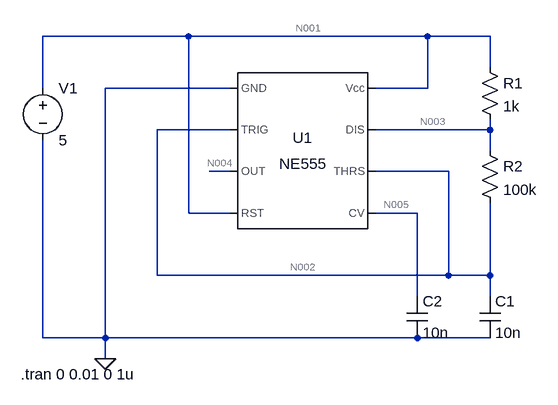
[diagram p0: schematic Draft1.asc]
Draft1.asc, the LTspice schematic file:
Version 4
SHEET 1 880 680
WIRE 16 16 -208 16
WIRE 384 16 16 16
WIRE 480 16 384 16
WIRE 480 64 480 16
WIRE -208 96 -208 16
WIRE 80 96 -112 96
WIRE 384 96 384 16
WIRE 384 96 304 96
WIRE 80 160 -32 160
WIRE 480 160 480 144
WIRE 480 160 304 160
WIRE 480 192 480 160
WIRE 80 224 48 224
WIRE 416 224 304 224
WIRE 16 288 16 16
WIRE 80 288 16 288
WIRE 368 288 304 288
WIRE -32 384 -32 160
WIRE 416 384 416 224
WIRE 416 384 -32 384
WIRE 480 384 480 272
WIRE 480 384 416 384
WIRE 368 416 368 288
WIRE 480 416 480 384
WIRE -208 480 -208 176
WIRE -112 480 -112 96
WIRE -112 480 -208 480
WIRE 368 480 -112 480
WIRE 480 480 368 480
WIRE -112 512 -112 480
FLAG -112 512 0
SYMBOL Misc\\NE555 192 192 R0
SYMATTR InstName U1
SYMBOL voltage -208 80 R0
WINDOW 123 0 0 Left 0
WINDOW 39 0 0 Left 0
SYMATTR InstName V1
SYMATTR Value 5
SYMBOL res 464 48 R0
SYMATTR InstName R1
SYMATTR Value 1k
SYMBOL res 464 176 R0
SYMATTR InstName R2
SYMATTR Value 100k
SYMBOL cap 464 416 R0
SYMATTR InstName C1
SYMATTR Value 10n
SYMBOL cap 352 416 R0
SYMATTR InstName C2
SYMATTR Value 10n
TEXT -242 536 Left 2 !.tran 0 0.01 0 1u

The netlist it stands for:
* Draft1.asc
XU1 0 N002 N004 N001 N005 N002 N003 N001 NE555  ; pins GND TRIG OUT RST CV THRS DIS Vcc
V1 N001 0 5
R1 N001 N003 1k
R2 N003 N002 100k
C1 N002 0 10n
C2 N005 0 10n
.tran 0 0.01 0 1u
.lib NE555.sub
.backanno
.end

* Results of the author's LTspice run, read from the files saved beside the schematic
* Operating Point, zero values left out:
*   V(n002) = 4.999 V
*   V(n005) = 3.333 V
*   V(n001) = 5 V
*   V(n003) = 5 V
*   V(n004) = 5 V
*   I(R2) = 9.998 nA
*   I(R1) = 16.67 nA
*   I(V1) = -1.611 mA
*   Ix(u1:1) = -1.611 mA
*   Ix(u1:2) = 4.999 nA
*   Ix(u1:4) = 22.67 µA
*   Ix(u1:6) = 4.999 nA
*   Ix(u1:7) = 6.672 nA
*   Ix(u1:8) = 1.588 mA
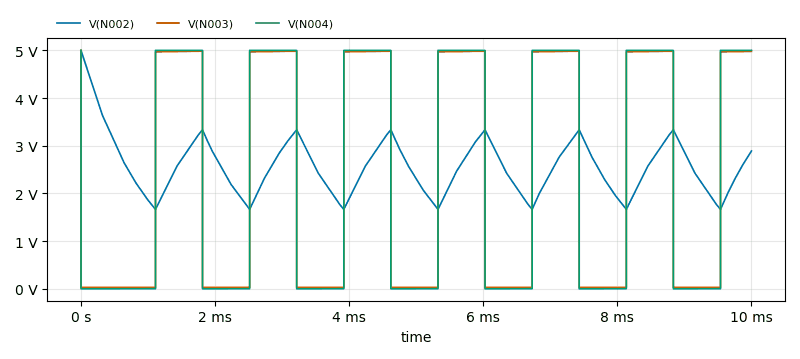
[diagram p1: Transient Analysis of Draft1.asc, plotted from the saved traces]
* Transient Analysis, 1 run:
*   V(N002): min 1.666 V, max 4.999 V, average 2.552 V, rms 2.633 V, last 2.889 V
*   V(N003): min 29.92 mV, max 5 V, average 2.34 V, rms 3.4 V, last 4.979 V
*   V(N004): min 30 µV, max 5 V, average 2.335 V, rms 3.417 V, last 5 V